# Altium project BABA03A_V3.0.0.PrjPcb
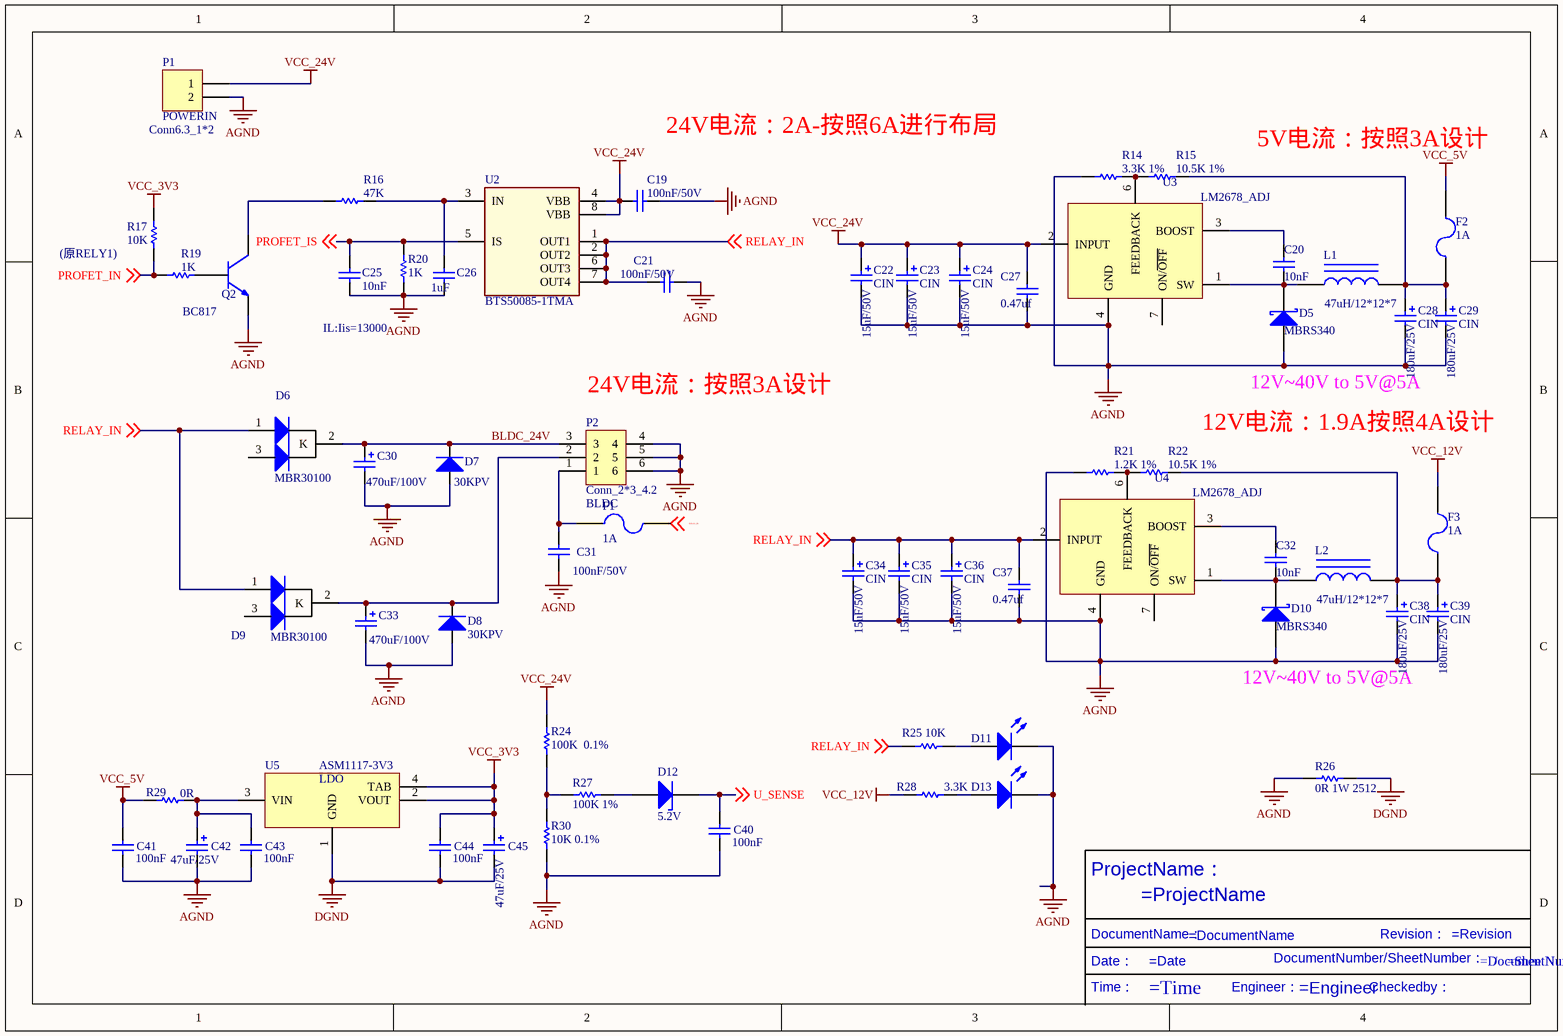
[diagram p0: Power.SchDoc]
4 sheets, 189 parts. Net scope: global (net labels, ports and power ports of the same name join across sheets).
Board file: BABA03A_V3.0.0.PcbDoc
Sheets:
  Power.SchDoc
  Mcu.SchDoc
  Connector.SchDoc
  Motor Control.SchDoc

## Sheet Power.SchDoc
size A4

### Parts
C19  value 100nF/50V  [C0805]  (hidden comment: Cap)
C20  value 10nF  [C0805]  (hidden comment: Cap)
C21  value 100nF/50V  [C0805]  (hidden comment: Cap)
C22  CIN  value 15uF/50V  [CAP-7343]
C23  CIN  value 15uF/50V  [CAP-7343]
C24  CIN  value 15uF/50V  [CAP-7343]
C25  value 10nF  [C0805]  (hidden comment: Cap)
C26  value 1uF  [C0805]  (hidden comment: Cap)
C27  value 0.47uf  [C0805]  (hidden comment: Cap)
C28  CIN  value 180uF/25V  [CAP-7343]
C29  CIN  value 180uF/25V  [CAP-7343]
C30  value 470uF/100V  [CTH-R9-D7]  (hidden comment: Cap Pol1)
C31  value 100nF/50V  [C0805]  (hidden comment: Cap)
C32  value 10nF  [C0805]  (hidden comment: Cap)
C33  value 470uF/100V  [CTH-R9-D7]  (hidden comment: Cap Pol1)
C34  CIN  value 15uF/50V  [CAP-7343]
C35  CIN  value 15uF/50V  [CAP-7343]
C36  CIN  value 15uF/50V  [CAP-7343]
C37  value 0.47uf  [C0805]  (hidden comment: Cap)
C38  CIN  value 180uF/25V  [CAP-7343]
C39  CIN  value 180uF/25V  [CAP-7343]
C40  value 100nF  [C0805]  (hidden comment: Cap)
C41  value 100nF  [C0805]  (hidden comment: Cap)
C42  value 47uF/25V  [CAP-1206]  (hidden comment: Cap Pol1)
C43  value 100nF  [C0805]  (hidden comment: Cap)
C44  value 100nF  [C0805]  (hidden comment: Cap)
C45  value 47uF/25V  [CAP-1206]  (hidden comment: Cap Pol1)
D5  value MBRS340  [DIODE-SMC]  (hidden comment: D Schottky)
D6  MBR30100  [TO-263-3]
D7  Type: 30KPV  [DIODE]  (hidden comment: TVS)
D8  Type: 30KPV  [DIODE]  (hidden comment: TVS)
D9  MBR30100  [TO-263-3]
D10  value MBRS340  [DIODE-SMC]  (hidden comment: D Schottky)
D11  LED0  [LED_0805]  (value not drawn)
D12  value 5.2V  [DIODE-1206]  (hidden comment: Diode-Z)
D13  LED0  [LED_0805]  (value not drawn)
F1  value 1A  [1812]  (hidden comment: Fuse)
F2  value 1A  [1812]  (hidden comment: Fuse)
F3  value 1A  [1812]  (hidden comment: Fuse)
L1  value 47uH/12*12*7  [L-SMD-12]  (hidden comment: Inductor Iron)
L2  value 47uH/12*12*7  [L-SMD-12]  (hidden comment: Inductor Iron)
P1  POWERIN  [DIP2*6.3]
P2  Conn_2*3_4.2  Conn4.2: BLDC  [PIN2X3_4.2]
Q2  BC817  [SOT-23_N]
R14  value 3.3K 1%  [R0805]  (hidden comment: Res1)
R15  value 10.5K 1%  [R0805]  (hidden comment: Res1)
R16  value 47K  [R0805]  (hidden comment: Res1)
R17  value 10K  [R0805]  (hidden comment: Res1)
R19  value 1K  [R0805]  (hidden comment: Res1)
R20  value 1K  [R0805]  (hidden comment: Res1)
R21  value 1.2K 1%  [R0805]  (hidden comment: Res1)
R22  value 10.5K 1%  [R0805]  (hidden comment: Res1)
R24  value 100K  0.1%  [R0805]  (hidden comment: Res1)
R25  value 10K  [R0805]  (hidden comment: Res1)
R26  value 0R 1W 2512  [2512]  (hidden comment: Res1)
R27  value 100K 1%  [R0805]  (hidden comment: Res1)
R28  value 3.3K  [R0805]  (hidden comment: Res1)
R29  value 0R  [R0805]  (hidden comment: Res1)
R30  value 10K 0.1%  [R0805]  (hidden comment: Res1)
U2  BTS50085-1TMA  [TO127P1385X450-8N-V]
U3  LM2678_ADJ  [TO-263-7]
U4  LM2678_ADJ  [TO-263-7]
U5  ASM1117-3V3  [ASM1117-3V3]

### Nets
AGND: C19.1 C21.1 C22.2 C23.2 C24.2 C25.2 C26.2 C27.1 C28.2 C29.2 C30.2 C31.2 C33.2 C34.2 C35.2 C36.2 C37.1 C38.2 C39.2 C40.1 C41.1 C42.2 C43.1 D5.1(A) D7.1(A) D8.1(A) D10.1(A) D11.2(K) D13.2(K) P1.2 P2.4 P2.5 P2.6 Q2.2(E) R14.1 R20.1 R21.1 R26.1 R30.2 U3.4(GND) U4.4(GND)
DGND: C44.1 C45.2 R26.2 U5.1(GND)
VCC_3V3: C44.2 C45.1 R17.1 U5.2(VOUT) U5.4(TAB)
VCC_5V: C41.2 F2.2 R29.1
VCC_12V: F3.2 R28.2
VCC_24V: C19.2 C22.1 C23.1 C24.1 C27.2 P1.1 R24.1 U2.4(VBB) U2.8(VBB) U3.2(INPUT)
BLDC_24V: C30.1 D6.2(K) D7.2(K) P2.3
PROFET_IN: R17.2 R19.2 ; off-sheet PROFET_IN
PROFET_IS: C25.1 R20.2 U2.5(IS) ; off-sheet PROFET_IS
RELAY_IN: C21.2 C34.1 C35.1 C36.1 C37.2 D6.1(A) D9.1(A) F1.2 R25.2 U2.1(OUT1) U2.2(OUT2) U2.6(OUT3) U2.7(OUT4) U4.2(INPUT) ; off-sheet RELAY_IN
U_SENSE: C40.2 D12.2(K) ; off-sheet U_SENSE
NetC20_1: C20.1 D5.2(K) L1.1 U3.1(SW)
NetC20_2: C20.2 U3.3(BOOST)
NetC26_1: C26.1 R16.2 U2.3(IN)
NetC28_1: C28.1 C29.1 F2.1 L1.2 R15.2
NetC31_1: C31.1 F1.1 P2.1
NetC32_1: C32.1 D10.2(K) L2.1 U4.1(SW)
NetC32_2: C32.2 U4.3(BOOST)
NetC33_1: C33.1 D8.2(K) D9.2(K) P2.2
NetC38_1: C38.1 C39.1 F3.1 L2.2 R22.2
NetC42_1: C42.1 C43.2 R29.2 U5.3(VIN)
NetD11_1: D11.1(A) R25.1
NetD12_1: D12.1(A) R27.2
NetD13_1: D13.1(A) R28.1
NetQ2_1: Q2.1(B) R19.1
NetQ2_3: Q2.3(C) R16.1
NetR14_2: R14.2 R15.1 U3.6(FEEDBACK)
NetR21_2: R21.2 R22.1 U4.6(FEEDBACK)
NetR24_2: R24.2 R27.1 R30.1

Not connected (* = marked no-connect by the designer): D6 3(A); D9 3(A); U3 7(ON/~{OFF}); U4 7(ON/~{OFF})

### Notes on the sheet
- (near P1) Conn6.3_1*2
- 24V电流：2A-按照6A进行布局
- 5V电流：按照3A设计
- (原RELY1)
- IL:Iis=13000
- (near P2) 24V电流：按照3A设计
- 12V电流：1.9A按照4A设计
- 12V~40V to 5V@5A
- Labels drawn without touching a wire or pin: /, =Date, =DocumentName, =DocumentNumber, =Engineer, =ProjectName, =Revision, =SheetNumber, =Time, Checkedby：, Date：, DocumentName：, DocumentNumber/SheetNumber：, Engineer：, ProjectName：, Revision：, Time：

### Library data of the parts
C19-C21 C25 C26 C31 C32 C40 C41 C43 C44 = Cap: Capacitor; Published: 8-Jun-2000; LatestRevisionDate: 17-Jul-2002; LatestRevisionNote: Re-released for DXP Platform.; PackageReference: RAD-0.3; Publisher: Altium Limited; PackageDescription: Radial Cap, Thru-Hole; 2 Leads; 0.3 in Pin Spacing
C22-C24 C28-C30 C33-C36 C38 C39 C42 C45 = Cap Pol1: Polarized Capacitor (Radial); Published: 8-Jun-2000; LatestRevisionDate: 17-Jul-2002; LatestRevisionNote: Re-released for DXP Platform.; PackageReference: RB7.6-15; Publisher: Altium Limited; PackageDescription: Polarized Capacitor (Radial); 2 Leads
C27 C37 = Cap: CC; Published: 8-Jun-2000; LatestRevisionDate: 17-Jul-2002; LatestRevisionNote: Re-released for DXP Platform.; PackageReference: RAD-0.3; Publisher: Altium Limited; PackageDescription: Radial Cap, Thru-Hole; 2 Leads; 0.3 in Pin Spacing
D5 D10 = D Schottky: Schottky Diode; Published: 8-Jun-2000; LatestRevisionDate: 17-Jul-2002; LatestRevisionNote: Re-released for DXP Platform.; PackageReference: SMB; Code_JEDEC: DO-214-AA
D6 D9 = MBR30100: Dual Diode; Published: 8-Jun-2000; LatestRevisionDate: 17-Jul-2002; LatestRevisionNote: Re-released for DXP Platform.; PackageVersion: Sep-1996; PackageReference: SMC; Publisher: Altium Limited; PackageDescription: DO-214-AB/SMC; 2 C-Bend Leads; Body 7.9 x 5.9 mm, inc. leads (LxW); Code_JEDEC: DO-214-AB
D7 D8 = TVS: TVS保护; Published: 8-Jun-2000; LatestRevisionDate: 17-Jul-2002; LatestRevisionNote: Re-released for DXP Platform.; PackageDocument: Sep-1996; PackageReference: SMC; Publisher: Altium Limited; Code_JEDEC: DO-214-AB
D11 D13 = LED0: 发光二极管; Published: 8-Jun-2000; LatestRevisionDate: 08-Jul-2005; LatestRevisionNote: Mech Layer 1 removed.; PackageReference: LED-0; Publisher: Altium Limited
D12 = Diode-Z: 稳压二极管; Published: 8-Jun-2000; LatestRevisionDate: 17-Jul-2002; LatestRevisionNote: Re-released for DXP Platform.; PackageReference: SMB; Publisher: Altium Limited; Code_JEDEC: DO-214-AA
F1-F3 = Fuse 2: 保险丝; Published: 8-Jun-2000; LatestRevisionDate: 17-Jul-2002; LatestRevisionNote: Re-released for DXP Platform.; PackageReference: PIN-W2/E2.8; Publisher: Altium Limited
L1 L2 = Inductor Iron: Magnetic-Core Inductor; Published: 24-Mar-1999; LatestRevisionDate: 17-Jul-2002; LatestRevisionNote: Re-released for DXP Platform.; PackageReference: AXIAL-0.9; Publisher: Altium Limited; PackageDescription: Axial Device, Thru-Hole; 2 Leads; 0.9 in Pin Spacing
P1 = Header 2: Conn6.3_1*2
Q2 = mNPN: NPN 45V 功耗 310mW; Value: BC817
R14-R17 R19-R22 R24-R30 = Res1: Resistor; Published: 8-Jun-2000; LatestRevisionDate: 17-Jul-2002; LatestRevisionNote: Re-released for DXP Platform.; PackageReference: AXIAL-0.3; Publisher: Altium Limited; PackageDescription: Axial Device, Thru-Hole; 2 Leads; 0.3 in Pin Spacing
U2 = BTS50085-1TMA: Smart Highside High Current Power Switch, VBB 70V; Manufacturer: Infineon Technologies; ManufacturerPartNumber: BTS50085-1TMA; PackageReference: PG-TO220-7-4
U3 U4 = LM2678
U5 = LDO

## Sheet Mcu.SchDoc
size A4
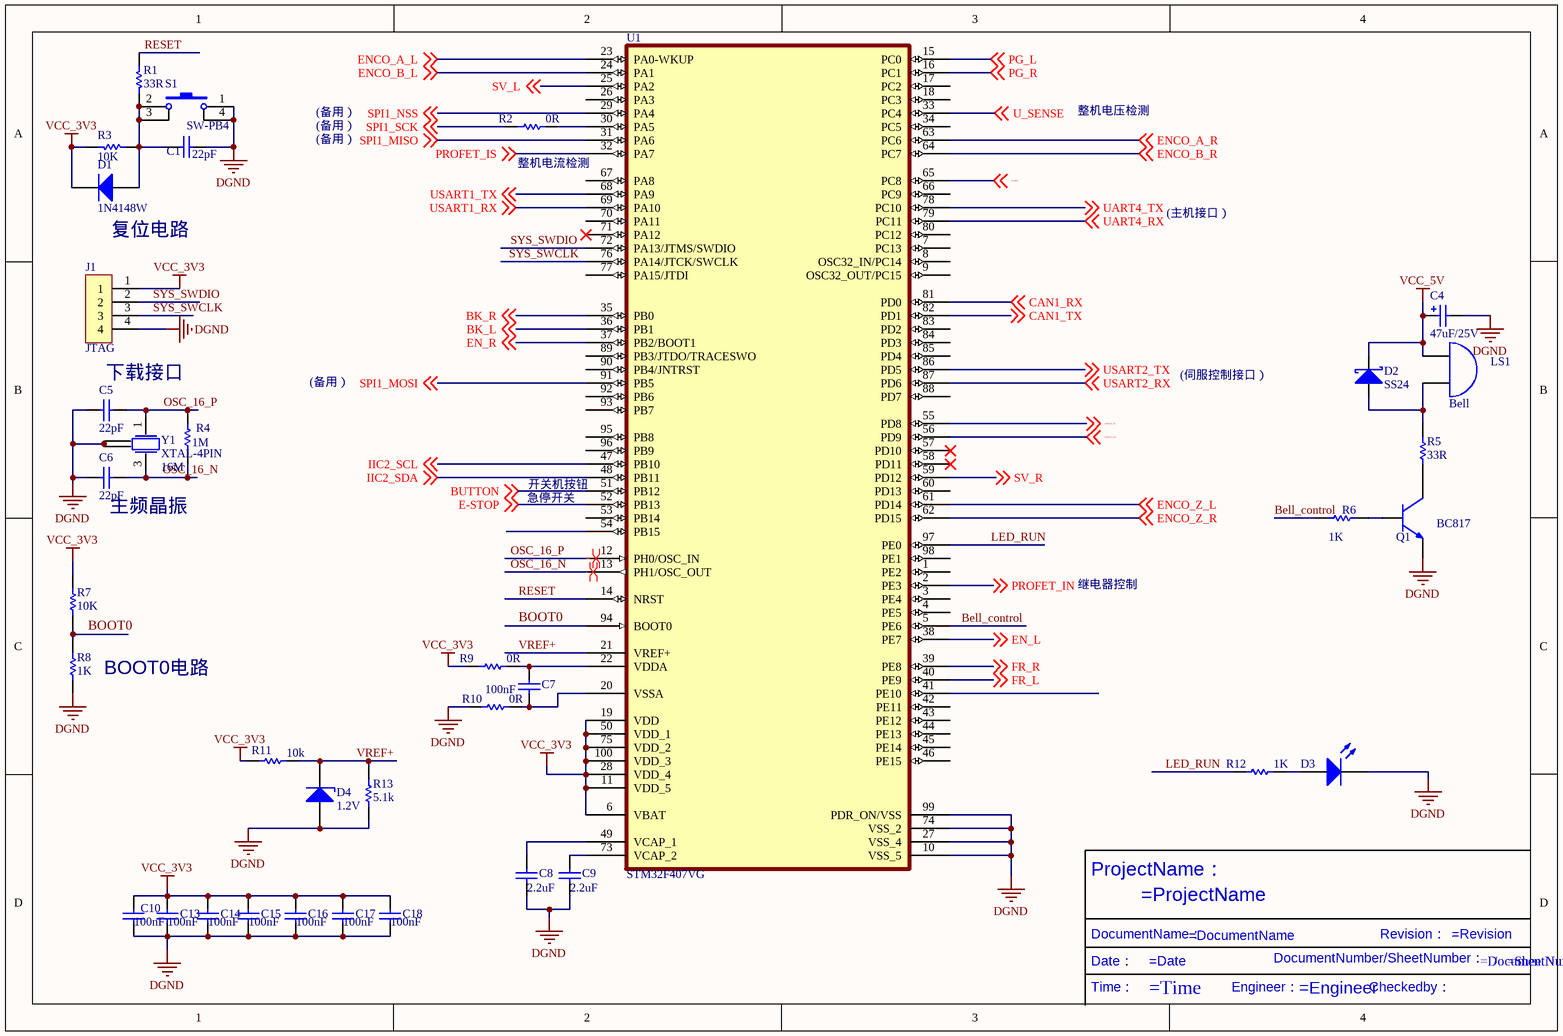
[diagram p1: Mcu.SchDoc]

### Parts
C1  value 22pF  [C0805]  (hidden comment: Cap)
C4  value 47uF/25V  [CAP-1206]  (hidden comment: Cap Pol1)
C5  value 22pF  [C0805]  (hidden comment: Cap)
C6  value 22pF  [C0805]  (hidden comment: Cap)
C7  value 100nF  [C0805]  (hidden comment: Cap)
C8  value 2.2uF  [C0805]  (hidden comment: Cap)
C9  value 2.2uF  [C0805]  (hidden comment: Cap)
C10  value 100nF  [C0805]  (hidden comment: Cap)
C13  value 100nF  [C0805]  (hidden comment: Cap)
C14  value 100nF  [C0805]  (hidden comment: Cap)
C15  value 100nF  [C0805]  (hidden comment: Cap)
C16  value 100nF  [C0805]  (hidden comment: Cap)
C17  value 100nF  [C0805]  (hidden comment: Cap)
C18  value 100nF  [C0805]  (hidden comment: Cap)
D1  value 1N4148W  [DIODE-1206]  (hidden comment: Diode)
D2  value SS24  [DIODE-SMA]  (hidden comment: Diode-Schottky)
D3  LED0  [LED_0805]  (value not drawn)
D4  value 1.2V  [DIODE-1206]  (hidden comment: Diode-Z)
J1  JTAG  [PORT-SIP4-2.54]
LS1  Bell  [PIN2]
Q1  BC817  [SOT-23_N]
R1  value 33R  [R0805]  (hidden comment: Res1)
R2  value 0R  [R0805]  (hidden comment: Res1)
R3  value 10K  [R0805]  (hidden comment: Res1)
R4  value 1M  [R0805]  (hidden comment: Res1)
R5  value 33R  [R0805]  (hidden comment: Res1)
R6  value 1K  [R0805]  (hidden comment: Res1)
R7  value 10K  [R0805]  (hidden comment: Res1)
R8  value 1K  [R0805]  (hidden comment: Res1)
R9  value 0R  [R0805]  (hidden comment: Res1)
R10  value 0R  [R0805]  (hidden comment: Res1)
R11  value 10k  [R0805]  (hidden comment: Res1)
R12  value 1K  [R0805]  (hidden comment: Res1)
R13  value 5.1k  [R0805]  (hidden comment: Res1)
S1  SW-PB4  [RESET-SMD-1O4]
U1  STM32F407VG  [100T1_N]
Y1  XTAL-4PIN  value 16M  [EPSON-16M]

### Nets
DGND: C1.1 C4.2 C5.1 C6.2 C8.2 C9.2 C10.2 C13.2 C14.2 C15.2 C16.2 C17.2 C18.2 D3.2(K) D4.1(A) J1.4 Q1.2(E) R8.1 R10.2 R13.1 S1.1 S1.4 U1.10(VSS_5) U1.27(VSS_4) U1.74(VSS_2) U1.99(PDR_ON/VSS) Y1.2 Y1.4
VCC_3V3: C10.1 C13.1 C14.1 C15.1 C16.1 C17.1 C18.1 D1.2(K) J1.1 R3.2 R7.1 R9.2 R11.2 U1.6(VBAT) U1.11(VDD_5) U1.19(VDD) U1.28(VDD_4) U1.50(VDD_1) U1.75(VDD_2) U1.100(VDD_3)
VCC_5V: C4.1 D2.2(K) LS1.1(A)
B-STOP: U1.65(PC8) ; off-sheet B-STOP
Bell_control: R6.2 U1.5(PE6)
BK_L: U1.36(PB1) ; off-sheet BK_L
BK_R: U1.35(PB0) ; off-sheet BK_R
BOOT0: R7.2 R8.2 U1.94(BOOT0)
BUTTON: U1.51(PB12) ; off-sheet BUTTON
CAN1_RX: U1.81(PD0) ; off-sheet CAN1_RX
CAN1_TX: U1.82(PD1) ; off-sheet CAN1_TX
E-STOP: U1.52(PB13) ; off-sheet E-STOP
EN_L: U1.38(PE7) ; off-sheet EN_L
EN_R: U1.37(PB2/BOOT1) ; off-sheet EN_R
ENCO_A_L: U1.23(PA0-WKUP) ; off-sheet ENCO_A_L
ENCO_A_R: U1.63(PC6) ; off-sheet ENCO_A_R
ENCO_B_L: U1.24(PA1) ; off-sheet ENCO_B_L
ENCO_B_R: U1.64(PC7) ; off-sheet ENCO_B_R
ENCO_Z_L: U1.61(PD14) ; off-sheet ENCO_Z_L
ENCO_Z_R: U1.62(PD15) ; off-sheet ENCO_Z_R
FR_L: U1.40(PE9) ; off-sheet FR_L
FR_R: U1.39(PE8) ; off-sheet FR_R
IIC2_SCL: U1.47(PB10) ; off-sheet IIC2_SCL
IIC2_SDA: U1.48(PB11) ; off-sheet IIC2_SDA
LED_RUN: R12.2 U1.97(PE0)
OSC_16_N: C6.1 R4.1 U1.13(PH1/OSC_OUT) Y1.3
OSC_16_P: C5.2 R4.2 U1.12(PH0/OSC_IN) Y1.1
PG_L: U1.15(PC0) ; off-sheet PG_L
PG_R: U1.16(PC1) ; off-sheet PG_R
PROFET_IN: U1.2(PE3) ; off-sheet PROFET_IN
PROFET_IS: U1.32(PA7) ; off-sheet PROFET_IS
RESET: R1.1 U1.14(NRST)
SPI1_MISO: U1.31(PA6) ; off-sheet SPI1_MISO
SPI1_MOSI: U1.91(PB5) ; off-sheet SPI1_MOSI
SPI1_NSS: U1.29(PA4) ; off-sheet SPI1_NSS
SPI1_SCK: R2.2 ; off-sheet SPI1_SCK
SV_L: U1.25(PA2) ; off-sheet SV_L
SV_R: U1.59(PD12) ; off-sheet SV_R
SYS_SWCLK: J1.3 U1.76(PA14/JTCK/SWCLK)
SYS_SWDIO: J1.2 U1.72(PA13/JTMS/SWDIO)
U_SENSE: U1.33(PC4) ; off-sheet U_SENSE
UART4_RX: U1.79(PC11) ; off-sheet UART4_RX
UART4_TX: U1.78(PC10) ; off-sheet UART4_TX
USART1_RX: U1.69(PA10) ; off-sheet USART1_RX
USART1_TX: U1.68(PA9) ; off-sheet USART1_TX
USART2_RX: U1.87(PD6) ; off-sheet USART2_RX
USART2_TX: U1.86(PD5) ; off-sheet USART2_TX
USART3_RX: U1.56(PD9) ; off-sheet USART3_RX
USART3_TX: U1.55(PD8) ; off-sheet USART3_TX
VREF+: D4.2(K) R11.1 R13.2 U1.21(VREF+)
NetC1_2: C1.2 D1.1(A) R1.2 R3.1 S1.2 S1.3
NetC7_1: C7.1 R10.1 U1.20(VSSA)
NetC7_2: C7.2 R9.1 U1.22(VDDA)
NetC8_1: C8.1 U1.49(VCAP_1)
NetC9_1: C9.1 U1.73(VCAP_2)
NetD2_1: D2.1(A) LS1.2(B) R5.1
NetD3_1: D3.1(A) R12.1
NetQ1_1: Q1.1(B) R6.1
NetQ1_3: Q1.3(C) R5.2
NetR2_1: R2.1 U1.30(PA5)

Not connected (* = marked no-connect by the designer): U1 1(PE2) 3(PE4) 4(PE5) 7(PC13) 8(OSC32_IN/PC14) 9(OSC32_OUT/PC15) 17(PC2) 18(PC3) 26(PA3) 34(PC5) 41(PE10) 42(PE11) 43(PE12) 44(PE13) 45(PE14) 46(PE15) 53(PB14) 54(PB15) 57(PD10)* 58(PD11)* 60(PD13) 66(PC9) 67(PA8) 70(PA11) 71(PA12)* 77(PA15/JTDI) 80(PC12) 83(PD2) 84(PD3) 85(PD4) 88(PD7) 89(PB3/JTDO/TRACESWO) 90(PB4/JNTRST) 92(PB6) 93(PB7) 95(PB8) 96(PB9) 98(PE1)

### Layout directives
differential pair: OSC_16_N, OSC_16_P

### Notes on the sheet
- (备用）
- 整机电压检测
- (near R2) 整机电流检测
- 复位电路
- (主机接口）
- 下载接口
- (伺服控制接口）
- (near C6) 主频晶振
- 急停开关
- 开关机按钮
- 继电器控制
- (near R8) BOOT0电路
- Labels drawn without touching a wire or pin: /, =Date, =DocumentName, =DocumentNumber, =Engineer, =ProjectName, =Revision, =SheetNumber, =Time, Checkedby：, Date：, DocumentName：, DocumentNumber/SheetNumber：, Engineer：, ProjectName：, Revision：, Time：

### Library data of the parts
C1 C5-C10 C13-C18 = Cap: Capacitor; Published: 8-Jun-2000; LatestRevisionDate: 17-Jul-2002; LatestRevisionNote: Re-released for DXP Platform.; PackageReference: RAD-0.3; Publisher: Altium Limited; PackageDescription: Radial Cap, Thru-Hole; 2 Leads; 0.3 in Pin Spacing
C4 = Cap Pol1: Polarized Capacitor (Radial); Published: 8-Jun-2000; LatestRevisionDate: 17-Jul-2002; LatestRevisionNote: Re-released for DXP Platform.; PackageReference: RB7.6-15; Publisher: Altium Limited; PackageDescription: Polarized Capacitor (Radial); 2 Leads
D1 = Diode: 二极管; Type: S01575; Published: 8-Jun-2000; LatestRevisionDate: 17-Jul-2002; LatestRevisionNote: Re-released for DXP Platform.; PackageDocument: Sep-1996; PackageReference: CD1206; Publisher: Altium Limited; Code_JEDEC: DO-214-AB
D2 = Diode-Schottky: 肖特基二极管; Published: 8-Jun-2000; LatestRevisionDate: 17-Jul-2002; LatestRevisionNote: Re-released for DXP Platform.; PackageReference: SMB; Publisher: Altium Limited; Code_JEDEC: DO-214-AA
D3 = LED0: 发光二极管; Published: 8-Jun-2000; LatestRevisionDate: 08-Jul-2005; LatestRevisionNote: Mech Layer 1 removed.; PackageReference: LED-0; Publisher: Altium Limited
D4 = Diode-Z: 稳压二极管; Published: 8-Jun-2000; LatestRevisionDate: 17-Jul-2002; LatestRevisionNote: Re-released for DXP Platform.; PackageReference: SMB; Publisher: Altium Limited; Code_JEDEC: DO-214-AA
J1 = Conn_1*4_1
LS1 = Bell: Electrical Bell; Published: 24-Mar-1999; LatestRevisionDate: 17-Jul-2002; LatestRevisionNote: Re-released for DXP Platform.; PackageReference: PIN2; Publisher: Altium Limited
Q1 = mNPN: NPN 45V 功耗 310mW; Value: BC817
R1-R13 = Res1: Resistor; Published: 8-Jun-2000; LatestRevisionDate: 17-Jul-2002; LatestRevisionNote: Re-released for DXP Platform.; PackageReference: AXIAL-0.3; Publisher: Altium Limited; PackageDescription: Axial Device, Thru-Hole; 2 Leads; 0.3 in Pin Spacing
S1 = SW-PB4: 微动开关; Published: 24-Mar-1999; LatestRevisionDate: 17-Jul-2002; LatestRevisionNote: Re-released for DXP Platform.; PackageReference: SPST-2; Publisher: Altium Limited

## Sheet Connector.SchDoc
size A4
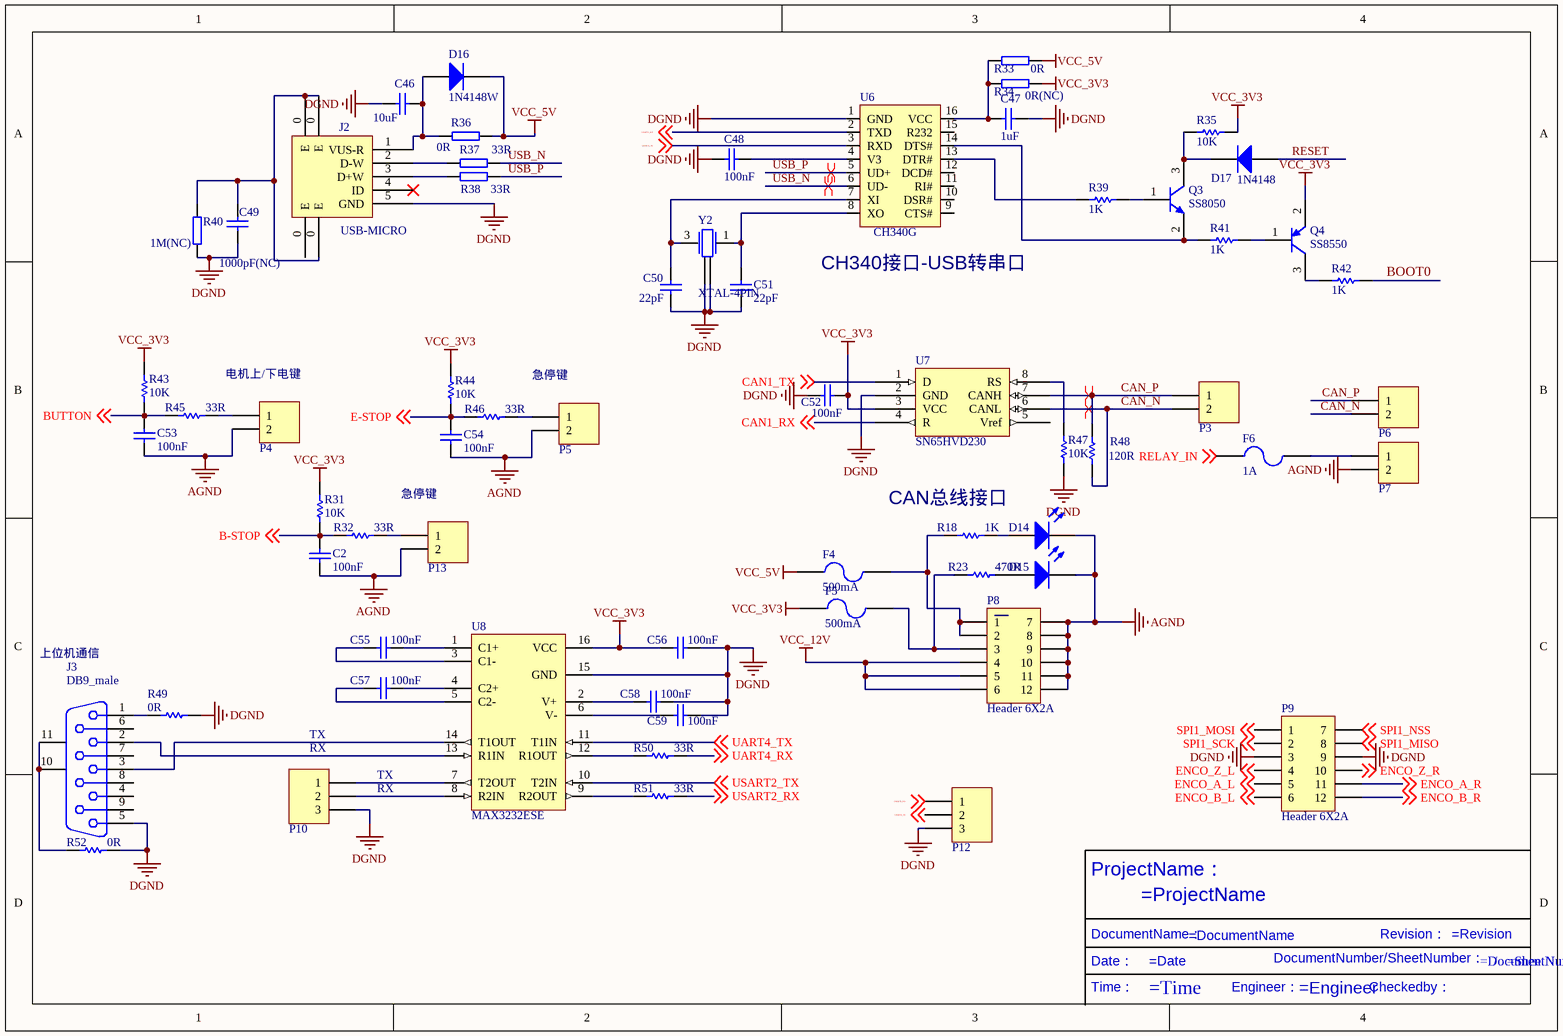
[diagram p2: Connector.SchDoc]

### Parts
C2  value 100nF  [C0805]  (hidden comment: Cap)
C46  value 10uF  [C0805]  (hidden comment: Cap)
C47  value 1uF  [C0805]  (hidden comment: Cap)
C48  value 100nF  [C0805]  (hidden comment: Cap)
C49  value 1000pF(NC)  [C0805]  (hidden comment: Cap)
C50  value 22pF  [C0805]  (hidden comment: Cap)
C51  value 22pF  [C0805]  (hidden comment: Cap)
C52  value 100nF  [C0805]  (hidden comment: Cap)
C53  value 100nF  [C0805]  (hidden comment: Cap)
C54  value 100nF  [C0805]  (hidden comment: Cap)
C55  value 100nF  [C0805]  (hidden comment: Cap)
C56  value 100nF  [C0805]  (hidden comment: Cap)
C57  value 100nF  [C0805]  (hidden comment: Cap)
C58  value 100nF  [C0805]  (hidden comment: Cap)
C59  value 100nF  [C0805]  (hidden comment: Cap)
D14  LED0  [LED_0805]  (value not drawn)
D15  LED0  [LED_0805]  (value not drawn)
D16  value 1N4148W  [DIODE-1206]  (hidden comment: Diode)
D17  value 1N4148  [DIODE-1206]  (hidden comment: Diode)
F4  value 500mA  [0805-1]  (hidden comment: Fuse)
F5  value 500mA  [0805-1]  (hidden comment: Fuse)
F6  value 1A  [1812]  (hidden comment: Fuse)
J2  USB-MICRO  [USB-MICRO-1]
J3  DB9_male  [DB9-M]
P3  Header 2  [HDR2X1_B1]  (value not drawn)
P4  Header 2  [MOLEX-2P]  (value not drawn)
P5  Header 2  [MOLEX-2P]  (value not drawn)
P6  Header 2  [HDR2X1_B1]  (value not drawn)
P7  Header 2  [HDR2X1_C]  (value not drawn)
P8  Header 6X2A  [Molex-12P]
P9  Header 6X2A  [Molex-12P]
P10  Header 3  [HDR3X1_B1]  (value not drawn)
P12  Header 3  [HDR3X1_B1]  (value not drawn)
P13  Header 2  [MOLEX-2P]  (value not drawn)
Q3  SS8050  [SOT-23]
Q4  SS8550  [SOT-23]
R18  value 1K  [R0805]  (hidden comment: Res1)
R23  value 470R  [R0805]  (hidden comment: Res1)
R31  value 10K  [R0805]  (hidden comment: Res1)
R32  value 33R  [R0805]  (hidden comment: Res1)
R33  value 0R  [R0805]  (hidden comment: Res1)
R34  value 0R(NC)  [R0805]  (hidden comment: Res1)
R35  value 10K  [R0805]  (hidden comment: Res1)
R36  value 0R  [R0805]  (hidden comment: Res1)
R37  value 33R  [R0805]  (hidden comment: Res1)
R38  value 33R  [R0805]  (hidden comment: Res1)
R39  value 1K  [R0805]  (hidden comment: Res1)
R40  value 1M(NC)  [R0805]  (hidden comment: RES)
R41  value 1K  [R0805]  (hidden comment: Res1)
R42  value 1K  [R0805]  (hidden comment: Res1)
R43  value 10K  [R0805]  (hidden comment: Res1)
R44  value 10K  [R0805]  (hidden comment: Res1)
R45  value 33R  [R0805]  (hidden comment: Res1)
R46  value 33R  [R0805]  (hidden comment: Res1)
R47  value 10K  [R0805]  (hidden comment: Res1)
R48  value 120R  [R0805]  (hidden comment: Res1)
R49  value 0R  [R0805]  (hidden comment: Res1)
R50  value 33R  [R0805]  (hidden comment: Res1)
R51  value 33R  [R0805]  (hidden comment: Res1)
R52  value 0R  [R0805]  (hidden comment: Res1)
U6  CH340G  [SOP16]
U7  SN65HVD230  [SO8-SN65HVD230]
U8  MAX3232ESE  [SOP16]
Y2  XTAL-4PIN  [EPSON-16M]

### Nets
AGND: C2.2 C53.2 C54.2 D14.2(K) D15.2(K) P4.2 P5.2 P7.2 P8.7 P8.8 P8.9 P8.10 P8.11 P8.12 P13.2
DGND: C46.2 C47.2 C48.2 C49.2 C50.2 C51.2 C52.1 C56.1 C58.1 C59.1 J2.5(GND) J3.5 P9.3 P9.9 P10.3 P12.3 R40.1 R47.2 R49.1 R52.1 U6.1(GND) U7.2(GND) U8.15(GND) Y2.2 Y2.4
VCC_3V3: C52.2 C56.2 F5.2 Q4.2(E) R31.2 R34.1 R35.1 R43.2 R44.2 U7.3(VCC) U8.16(VCC)
VCC_5V: D16.2(K) F4.2 R33.1 R36.1
VCC_12V: P8.4 P8.5 P8.6
B-STOP: C2.1 R31.1 R32.2 ; off-sheet B-STOP
BOOT0: R42.2
BUTTON: C53.1 R43.1 R45.2 ; off-sheet BUTTON
CAN1_RX: U7.4(R) ; off-sheet CAN1_RX
CAN1_TX: U7.1(D) ; off-sheet CAN1_TX
CAN_N: P3.2 P6.2 R48.2 U7.6(CANL)
CAN_P: P3.1 P6.1 R48.1 U7.7(CANH)
E-STOP: C54.1 R44.1 R46.2 ; off-sheet E-STOP
ENCO_A_L: P9.5 ; off-sheet ENCO_A_L
ENCO_A_R: P9.11 ; off-sheet ENCO_A_R
ENCO_B_L: P9.6 ; off-sheet ENCO_B_L
ENCO_B_R: P9.12 ; off-sheet ENCO_B_R
ENCO_Z_L: P9.4 ; off-sheet ENCO_Z_L
ENCO_Z_R: P9.10 ; off-sheet ENCO_Z_R
RELAY_IN: F6.2 ; off-sheet RELAY_IN
RESET: D17.1(A)
SPI1_MISO: P9.8 ; off-sheet SPI1_MISO
SPI1_MOSI: P9.1 ; off-sheet SPI1_MOSI
SPI1_NSS: P9.7 ; off-sheet SPI1_NSS
SPI1_SCK: P9.2 ; off-sheet SPI1_SCK
UART4_RX: R50.2 ; off-sheet UART4_RX
UART4_TX: U8.11(T1IN) ; off-sheet UART4_TX
USART1_RX: U6.2(TXD) ; off-sheet USART1_RX
USART1_TX: U6.3(RXD) ; off-sheet USART1_TX
USART2_RX: R51.2 ; off-sheet USART2_RX
USART2_TX: U8.10(T2IN) ; off-sheet USART2_TX
USART3_RX: P12.1 ; off-sheet USART3_RX
USART3_TX: P12.2 ; off-sheet USART3_TX
USB_N: R37.1 U6.6(UD-)
USB_P: R38.1 U6.5(UD+)
NetC46_1: C46.1 D16.1(A) J2.1(VUS-R) R36.2
NetC47_1: C47.1 R33.2 R34.2 U6.16(VCC)
NetC48_1: C48.1 U6.4(V3)
NetC49_1: C49.1 J2.0(E) R40.2
NetC50_1: C50.1 U6.7(XI) Y2.3
NetC51_1: C51.1 U6.8(XO) Y2.1
NetC55_1: C55.1 U8.1(C1+)
NetC55_2: C55.2 U8.3(C1-)
NetC57_1: C57.1 U8.4(C2+)
NetC57_2: C57.2 U8.5(C2-)
NetC58_2: C58.2 U8.2(V+)
NetC59_2: C59.2 U8.6(V-)
NetD14_1: D14.1(A) R18.1
NetD15_1: D15.1(A) R23.1
NetD17_2: D17.2(K) Q3.3(C) R35.2
NetF4_1: F4.1 P8.1 P8.2 R18.2
NetF5_1: F5.1 P8.3 R23.2
NetF6_1: F6.1 P7.1
NetJ2_2: J2.2(D-W) R37.2
NetJ2_3: J2.3(D+W) R38.2
NetJ3_1: J3.1 R49.2
NetJ3_2: J3.2 U8.13(R1IN)
NetJ3_3: J3.3 U8.14(T1OUT)
NetJ3_10: J3.10(MH1) J3.11(MH2) R52.2
NetP4_1: P4.1 R45.1
NetP5_1: P5.1 R46.1
NetP10_1: P10.1 U8.7(T2OUT)
NetP10_2: P10.2 U8.8(R2IN)
NetP13_1: P13.1 R32.1
NetQ3_1: Q3.1(B) R39.1
NetQ3_2: Q3.2(E) R41.2 U6.14(DTS#)
NetQ4_1: Q4.1(B) R41.1
NetQ4_3: Q4.3(C) R42.1
NetR39_2: R39.2 U6.13(DTR#)
NetR47_1: R47.1 U7.8(RS)
NetR50_1: R50.1 U8.12(R1OUT)
NetR51_1: R51.1 U8.9(R2OUT)

Not connected (* = marked no-connect by the designer): J2 4(ID)*; J3 4 6 7 8 9; U6 9(CTS#) 10(DSR#) 11(RI#) 12(DCD#) 15(R232); U7 5(Vref)

### Layout directives
differential pair: CAN_N, CAN_P, USB_N, USB_P

### Notes on the sheet
- (near U6) CH340接口-USB转串口
- 电机上/下电键
- 急停键
- (near R18) CAN总线接口
- 上位机通信
- (near P10) TX
- (near P10) RX
- Labels drawn without touching a wire or pin: /, =Date, =DocumentName, =DocumentNumber, =Engineer, =ProjectName, =Revision, =SheetNumber, =Time, Checkedby：, Date：, DocumentName：, DocumentNumber/SheetNumber：, Engineer：, ProjectName：, Revision：, Time：

### Library data of the parts
C2 C46-C59 = Cap: Capacitor; Published: 8-Jun-2000; LatestRevisionDate: 17-Jul-2002; LatestRevisionNote: Re-released for DXP Platform.; PackageReference: RAD-0.3; Publisher: Altium Limited; PackageDescription: Radial Cap, Thru-Hole; 2 Leads; 0.3 in Pin Spacing
D14 D15 = LED0: 发光二极管; Published: 8-Jun-2000; LatestRevisionDate: 08-Jul-2005; LatestRevisionNote: Mech Layer 1 removed.; PackageReference: LED-0; Publisher: Altium Limited
D16 D17 = Diode: 二极管; Type: S01575; Published: 8-Jun-2000; LatestRevisionDate: 17-Jul-2002; LatestRevisionNote: Re-released for DXP Platform.; PackageDocument: Sep-1996; PackageReference: CD1206; Publisher: Altium Limited; Code_JEDEC: DO-214-AB
F4-F6 = Fuse 2: 保险丝; Published: 8-Jun-2000; LatestRevisionDate: 17-Jul-2002; LatestRevisionNote: Re-released for DXP Platform.; PackageReference: PIN-W2/E2.8; Publisher: Altium Limited
J3 = D Connector 9: 串口; PackageDocument: O; Positions: 9; Gender: Receptacle; Published: 15-Jun-2001; LatestRevisionDate: 17-Jul-2002; LatestRevisionNote: Re-released for DXP Platform.; DatasheetDocument: 1-Sep-1999; PackageReference: 788750; Publisher: Altium Limited; Orientation: Right Angle
P3-P7 P13 = Header 2: 接插件; LatestRevisionDate: 17-Jul-2002; LatestRevisionNote: Re-released for DXP Platform.; Publisher: Altium Limited
P8 P9 = Header 6X2A: Header, 6-Pin, Dual row; LatestRevisionDate: 17-Jul-2002; LatestRevisionNote: Re-released for DXP Platform.; Publisher: Altium Limited
P10 P12 = Header 3: 接插件; LatestRevisionDate: 17-Jul-2002; LatestRevisionNote: Re-released for DXP Platform.; Publisher: Altium Limited
Q3 = SS8050: NPN贴片三极管; Published: 8-Jun-2000; LatestRevisionDate: 15-Jan-2003; LatestRevisionNote: PCB Footprint 'BCY-W3/D4.7' replaced; DatasheetDocument: 1997; PackageDocument: Sep-1998; PackageReference: TO-92A; Publisher: Altium Limited; Code_JEDEC: TO-92A; ComponentLink1Description: Manufacturer Link; ComponentLink1URL: http://www.fairchildsemi.com/; ComponentLink2Description: Datasheet; ComponentLink2URL: http://www.fairchildsemi.com/ds/2N%2F2N3904.pdf
Q4 = SS8550: PNP贴片三极管; Published: 8-Jun-2000; LatestRevisionDate: 15-Jan-2003; LatestRevisionNote: PCB Footprint 'BCY-W3/D4.7' replaced; DatasheetDocument: 1997; PackageDocument: Sep-1998; PackageReference: TO-92A; Publisher: Altium Limited; Code_JEDEC: TO-92A; ComponentLink1Description: Manufacturer Link; ComponentLink1URL: http://www.fairchildsemi.com/; ComponentLink2Description: Datasheet; ComponentLink2URL: http://www.fairchildsemi.com/ds/2N%2F2N3906.pdf
R18 R23 R31 R32 R35 R39 R41-R52 = Res1: Resistor; Published: 8-Jun-2000; LatestRevisionDate: 17-Jul-2002; LatestRevisionNote: Re-released for DXP Platform.; PackageReference: AXIAL-0.3; Publisher: Altium Limited; PackageDescription: Axial Device, Thru-Hole; 2 Leads; 0.3 in Pin Spacing
R33 R34 R36-R38 = RES
U7 = SN65HVD230D
U8 = MAX3232ESE: +5V Powered, Multi-Channel RS-232 Driver/Receiver; Published: 16-Jan-2001; LatestRevisionDate: 29-May-2009; LatestRevisionNote: Component Body Added.; PackageVersion: 1997; PackageReference: PE16A; Publisher: Altium Limited; PackageDescription: DIP, 16-Pin, Row Spacing 7.62 mm, Pitch 2.54 mm; Code_JEDEC: MS-001-BB; ComponentLink1Description: Manufacturer Link; ComponentLink1URL: http://www.maxim-ic.com/; ComponentLink2Description: Datasheet; ComponentLink2URL: http://pdfserv.maxim-ic.com/en/ds/MAX220-MAX249.pdf
Y2 = XTAL-4PIN: Value: 12M

## Sheet Motor Control.SchDoc
size A4
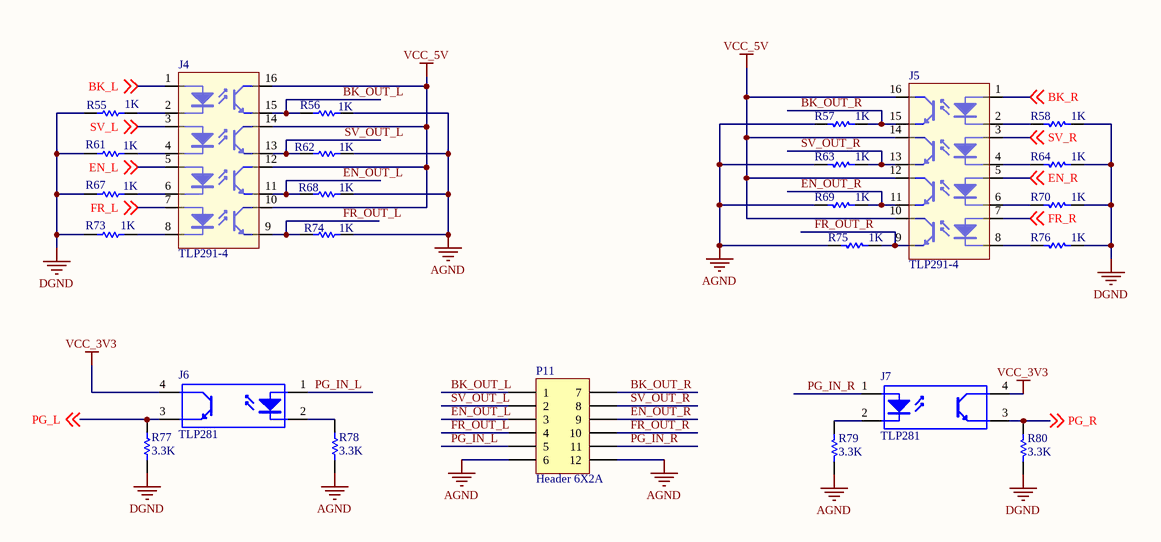
[diagram p3: Motor Control.SchDoc]

### Parts
J4  TLP291-4  [SOIC127P700X210-16N]
J5  TLP291-4  [SOIC127P700X210-16N]
J6  TLP281  [SOP127P710X350-4N]
J7  TLP281  [SOP127P710X350-4N]
P11  Header 6X2A  [Molex-12P]
R55  value 1K  [R0805]  (hidden comment: Res1)
R56  value 1K  [R0805]  (hidden comment: Res1)
R57  value 1K  [R0805]  (hidden comment: Res1)
R58  value 1K  [R0805]  (hidden comment: Res1)
R61  value 1K  [R0805]  (hidden comment: Res1)
R62  value 1K  [R0805]  (hidden comment: Res1)
R63  value 1K  [R0805]  (hidden comment: Res1)
R64  value 1K  [R0805]  (hidden comment: Res1)
R67  value 1K  [R0805]  (hidden comment: Res1)
R68  value 1K  [R0805]  (hidden comment: Res1)
R69  value 1K  [R0805]  (hidden comment: Res1)
R70  value 1K  [R0805]  (hidden comment: Res1)
R73  value 1K  [R0805]  (hidden comment: Res1)
R74  value 1K  [R0805]  (hidden comment: Res1)
R75  value 1K  [R0805]  (hidden comment: Res1)
R76  value 1K  [R0805]  (hidden comment: Res1)
R77  value 3.3K  [R0805]  (hidden comment: Res1)
R78  value 3.3K  [R0805]  (hidden comment: Res1)
R79  value 3.3K  [R0805]  (hidden comment: Res1)
R80  value 3.3K  [R0805]  (hidden comment: Res1)

### Nets
AGND: P11.6 P11.12 R56.2 R57.2 R62.2 R63.2 R68.2 R69.2 R74.2 R75.2 R78.2 R79.2
DGND: R55.2 R58.2 R61.2 R64.2 R67.2 R70.2 R73.2 R76.2 R77.1 R80.2
VCC_3V3: J6.4(C) J7.4(C)
VCC_5V: J4.10(C) J4.12(C) J4.14(C) J4.16(C) J5.10(C) J5.12(C) J5.14(C) J5.16(C)
BK_L: J4.1(A) ; off-sheet BK_L
BK_OUT_L: J4.15(E) P11.1 R56.1
BK_OUT_R: J5.15(E) P11.7 R57.1
BK_R: J5.1(A) ; off-sheet BK_R
EN_L: J4.5(A) ; off-sheet EN_L
EN_OUT_L: J4.11(E) P11.3 R68.1
EN_OUT_R: J5.11(E) P11.9 R69.1
EN_R: J5.5(A) ; off-sheet EN_R
FR_L: J4.7(A) ; off-sheet FR_L
FR_OUT_L: J4.9(E) P11.4 R74.1
FR_OUT_R: J5.9(E) P11.10 R75.1
FR_R: J5.7(A) ; off-sheet FR_R
PG_IN_L: J6.1(A) P11.5
PG_IN_R: J7.1(A) P11.11
PG_L: J6.3(E) R77.2 ; off-sheet PG_L
PG_R: J7.3(E) R80.1 ; off-sheet PG_R
SV_L: J4.3(A) ; off-sheet SV_L
SV_OUT_L: J4.13(E) P11.2 R62.1
SV_OUT_R: J5.13(E) P11.8 R63.1
SV_R: J5.3(A) ; off-sheet SV_R
NetJ4_2: J4.2(K) R55.1
NetJ4_4: J4.4(K) R61.1
NetJ4_6: J4.6(K) R67.1
NetJ4_8: J4.8(K) R73.1
NetJ5_2: J5.2(K) R58.1
NetJ5_4: J5.4(K) R64.1
NetJ5_6: J5.6(K) R70.1
NetJ5_8: J5.8(K) R76.1
NetJ6_2: J6.2(K) R78.1
NetJ7_2: J7.2(K) R79.1

### Notes on the sheet
- Labels drawn without touching a wire or pin: /, =Date, =DocumentName, =DocumentNumber, =Engineer, =ProjectName, =Revision, =SheetNumber, =Time, Checkedby：, Date：, DocumentName：, DocumentNumber/SheetNumber：, Engineer：, ProjectName：, Revision：, Time：

### Library data of the parts
J4 J5 = TLP291-4: 光耦
J6 J7 = TLP281: 光耦; Published: 24-Mar-1999; LatestRevisionDate: 04-Mar-2005; LatestRevisionNote: Sch pins 3 & 4 Swapped.; DatasheetDocument: Nov-2003; PackageReference: DIP-4; Publisher: Altium Limited
P11 = Header 6X2A: Header, 6-Pin, Dual row; LatestRevisionDate: 17-Jul-2002; LatestRevisionNote: Re-released for DXP Platform.; Publisher: Altium Limited
R55-R58 R61-R64 R67-R70 R73-R80 = Res1: Resistor; Published: 8-Jun-2000; LatestRevisionDate: 17-Jul-2002; LatestRevisionNote: Re-released for DXP Platform.; PackageReference: AXIAL-0.3; Publisher: Altium Limited; PackageDescription: Axial Device, Thru-Hole; 2 Leads; 0.3 in Pin Spacing

## Nets that join several sheets
AGND: Power (41 pins), Connector (15 pins), Motor Control (12 pins)
DGND: Power (C44.1 C45.2 R26.2 U5.1), Mcu (28 pins), Connector (25 pins), Motor Control (10 pins)
VCC_3V3: Power (5 pins), Mcu (20 pins), Connector (11 pins), Motor Control (J6.4 J7.4)
VCC_5V: Power (C41.2 F2.2 R29.1), Mcu (C4.1 D2.2 LS1.1), Connector (D16.2 F4.2 R33.1 R36.1), Motor Control (8 pins)
VCC_12V: Power (F3.2 R28.2), Connector (P8.4 P8.5 P8.6)
B-STOP: Mcu (U1.65), Connector (C2.1 R31.1 R32.2)
BK_L: Mcu (U1.36), Motor Control (J4.1)
BK_R: Mcu (U1.35), Motor Control (J5.1)
BOOT0: Mcu (R7.2 R8.2 U1.94), Connector (R42.2)
BUTTON: Mcu (U1.51), Connector (C53.1 R43.1 R45.2)
CAN1_RX: Mcu (U1.81), Connector (U7.4)
CAN1_TX: Mcu (U1.82), Connector (U7.1)
E-STOP: Mcu (U1.52), Connector (C54.1 R44.1 R46.2)
EN_L: Mcu (U1.38), Motor Control (J4.5)
EN_R: Mcu (U1.37), Motor Control (J5.5)
ENCO_A_L: Mcu (U1.23), Connector (P9.5)
ENCO_A_R: Mcu (U1.63), Connector (P9.11)
ENCO_B_L: Mcu (U1.24), Connector (P9.6)
ENCO_B_R: Mcu (U1.64), Connector (P9.12)
ENCO_Z_L: Mcu (U1.61), Connector (P9.4)
ENCO_Z_R: Mcu (U1.62), Connector (P9.10)
FR_L: Mcu (U1.40), Motor Control (J4.7)
FR_R: Mcu (U1.39), Motor Control (J5.7)
PG_L: Mcu (U1.15), Motor Control (J6.3 R77.2)
PG_R: Mcu (U1.16), Motor Control (J7.3 R80.1)
PROFET_IN: Power (R17.2 R19.2), Mcu (U1.2)
PROFET_IS: Power (C25.1 R20.2 U2.5), Mcu (U1.32)
RELAY_IN: Power (14 pins), Connector (F6.2)
RESET: Mcu (R1.1 U1.14), Connector (D17.1)
SPI1_MISO: Mcu (U1.31), Connector (P9.8)
SPI1_MOSI: Mcu (U1.91), Connector (P9.1)
SPI1_NSS: Mcu (U1.29), Connector (P9.7)
SPI1_SCK: Mcu (R2.2), Connector (P9.2)
SV_L: Mcu (U1.25), Motor Control (J4.3)
SV_R: Mcu (U1.59), Motor Control (J5.3)
U_SENSE: Power (C40.2 D12.2), Mcu (U1.33)
UART4_RX: Mcu (U1.79), Connector (R50.2)
UART4_TX: Mcu (U1.78), Connector (U8.11)
USART1_RX: Mcu (U1.69), Connector (U6.2)
USART1_TX: Mcu (U1.68), Connector (U6.3)
USART2_RX: Mcu (U1.87), Connector (R51.2)
USART2_TX: Mcu (U1.86), Connector (U8.10)
USART3_RX: Mcu (U1.56), Connector (P12.1)
USART3_TX: Mcu (U1.55), Connector (P12.2)